# EAGLE design untitled (EAGLE 9.4.2)
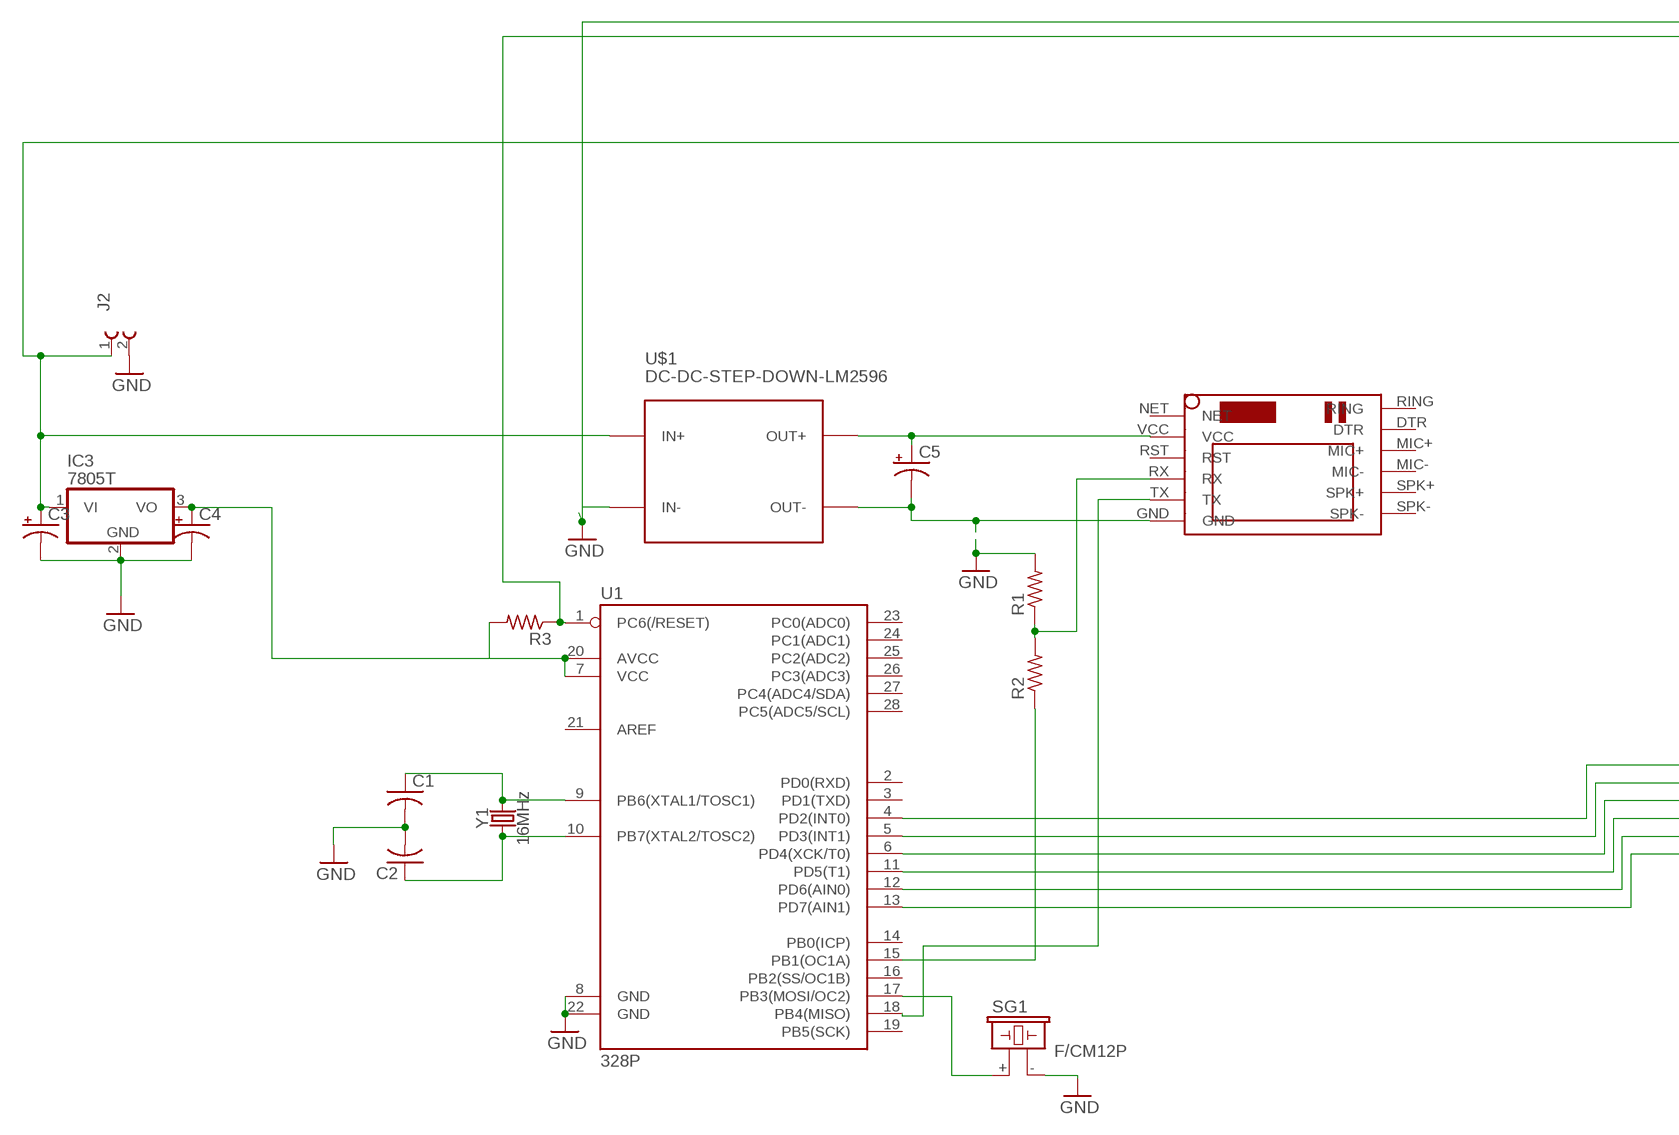
[diagram p0: schematic, sheet 1, part 1 of 2]
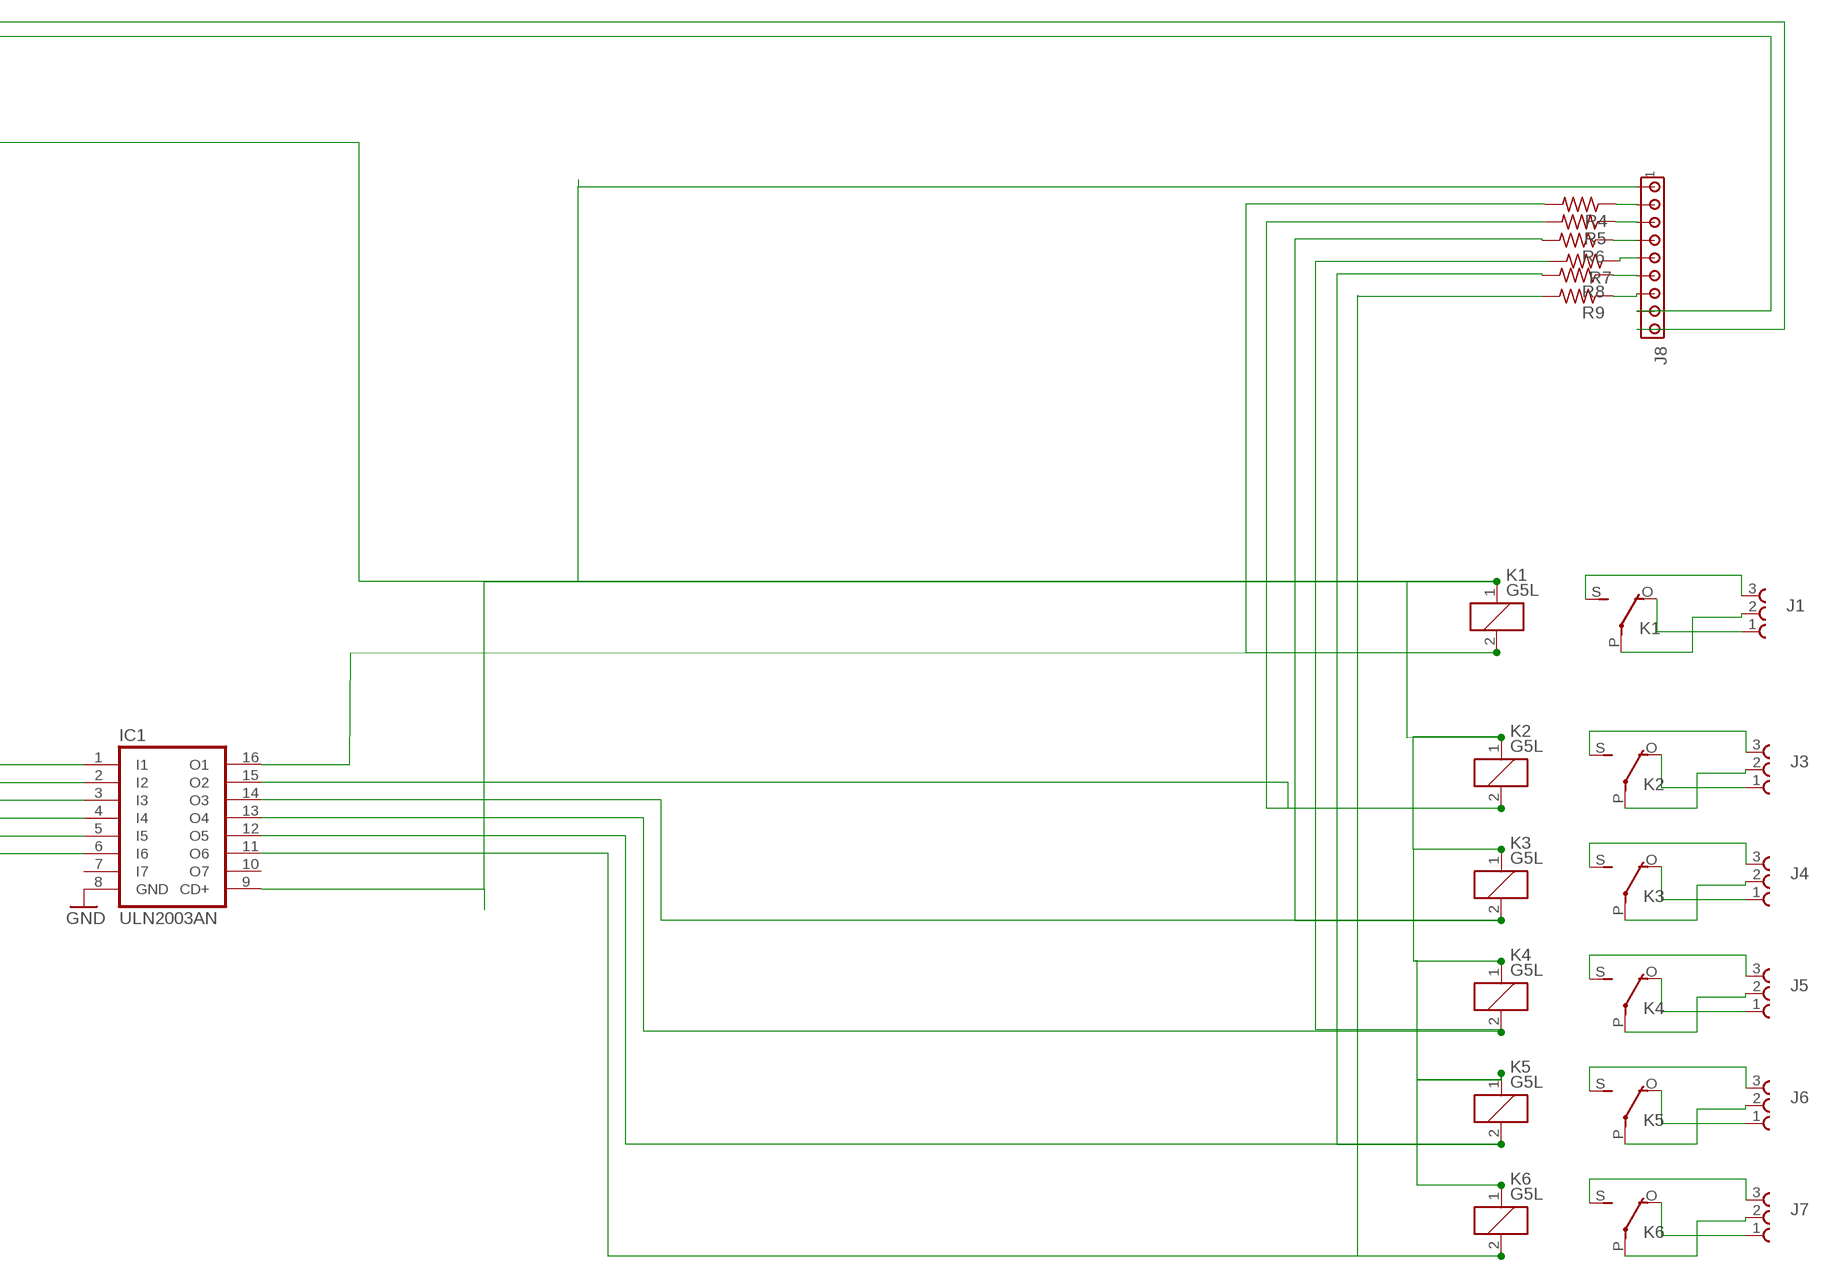
[diagram p1: schematic, sheet 1, part 2 of 2]

## Parts
C1  C-US025-024X044  [C025-024X044]
C2  C-US025-024X044  [C025-024X044]
C3  CPOL-USE2.5-5  [E2,5-5]
C4  CPOL-USE2.5-5  [E2,5-5]
C5  CAPACITOR-PE5-8.5  [E5-8,5]
IC1  ULN2003AN  [DIL16]
IC3  7805T  [TO220H]
J1  691216700003  [691216700003]
J2  691217910002  [691217910002]
J3  691216700003  [691216700003]
J4  691216700003  [691216700003]
J5  691216700003  [691216700003]
J6  691216700003  [691216700003]
J7  691216700003  [691216700003]
J8  MTA09-100  [10X09MTA]
K1  G5L  [G5LE]
K2  G5L  [G5LE]
K3  G5L  [G5LE]
K4  G5L  [G5LE]
K5  G5L  [G5LE]
K6  G5L  [G5LE]
R1  R-US_0204/7  [0204/7]
R2  R-US_0204/7  [0204/7]
R3  R-US_0204/7  [0204/7]
R4  R-US_0204/7  [0204/7]
R5  R-US_0204/7  [0204/7]
R6  R-US_0204/7  [0204/7]
R7  R-US_0204/7  [0204/7]
R8  R-US_0204/7  [0204/7]
R9  R-US_0204/7  [0204/7]
SG1  F/CM12P  [F/CM12P]
U1  328P  ATMEGA328P_PDIP  [DIP28]
U$1  DC-DC-STEP-DOWN-LM2596  [DC-DC-STEP-DOWN-LM2596]
U$2  SIM800LMODULE  [SIM800LMODULE]
Y1  16MHz  CRYSTAL-16MHZPTH-HC49US  [HC49US]

## Nets
GND: C1.2 C2.2 C3.- C4.- C5.- IC1.8(GND) IC3.2(GND) J2.2 J8.9 R1.2 SG1.- U1.8(GND) U1.22(GND) U$1.IN- U$1.OUT- U$2.GND
N$1: IC1.1(I1) U1.4(PD2(INT0))
N$2: C2.1 U1.10(PB7(XTAL2/TOSC2)) Y1.1
N$3: C1.1 U1.9(PB6(XTAL1/TOSC1)) Y1.2
N$4: IC1.2(I2) U1.5(PD3(INT1))
N$5: IC1.3(I3) U1.6(PD4(XCK/T0))
N$6: IC1.4(I4) U1.11(PD5(T1))
N$7: IC1.5(I5) U1.12(PD6(AIN0))
N$8: IC1.6(I6) U1.13(PD7(AIN1))
N$10: IC1.15(O2) K2.2 R5.2
N$11: C4.+ IC3.3(VO) R3.2 U1.7(VCC) U1.20(AVCC)
N$12: J8.2 R4.1
N$13: IC1.14(O3) K3.2 R6.2
N$14: IC1.13(O4) K4.2 R7.2
N$15: C5.+ U$1.OUT+ U$2.VCC
N$16: U1.18(PB4(MISO)) U$2.TX
N$17: R2.1 U1.15(PB1(OC1A))
N$18: R1.1 R2.2 U$2.RX
N$19: IC1.12(O5) K5.2 R8.2
N$20: J1.2 K1.P(2:P)
N$21: J1.3 K1.S(2:S)
N$22: J1.1 K1.O(2:O)
N$23: J8.3 R5.1
N$24: IC1.16(O1) K1.2 R4.2
N$25: J3.2 K2.P(2:P)
N$26: J3.3 K2.S(2:S)
N$27: J3.1 K2.O(2:O)
N$28: J8.8 R3.1 U1.1(PC6(/RESET))
N$29: J4.2 K3.P(2:P)
N$30: J4.3 K3.S(2:S)
N$31: J4.1 K3.O(2:O)
N$32: SG1.+ U1.17(PB3(MOSI/OC2))
N$33: J5.2 K4.P(2:P)
N$34: J5.3 K4.S(2:S)
N$35: J5.1 K4.O(2:O)
N$36: J8.4 R6.1
N$37: J6.2 K5.P(2:P)
N$38: J6.3 K5.S(2:S)
N$39: J6.1 K5.O(2:O)
N$40: C3.+ IC1.9(CD+) IC3.1(VI) J2.1 J8.1 K1.1 K2.1 K3.1 K4.1 K5.1 K6.1 U$1.IN+
N$41: J7.2 K6.P(2:P)
N$42: J7.3 K6.S(2:S)
N$43: J7.1 K6.O(2:O)
N$45: J8.5 R7.1
N$46: J8.6 R8.1
N$47: J8.7 R9.1
N$64: IC1.11(O6) K6.2 R9.2
Unconnected: IC1.7(I7) IC1.10(O7) U1.2(PD0(RXD)) U1.3(PD1(TXD)) U1.14(PB0(ICP)) U1.16(PB2(SS/OC1B)) U1.19(PB5(SCK)) U1.21(AREF) U1.23(PC0(ADC0)) U1.24(PC1(ADC1)) U1.25(PC2(ADC2)) U1.26(PC3(ADC3)) U1.27(PC4(ADC4/SDA)) U1.28(PC5(ADC5/SCL)) U$2.DTR U$2.MIC+ U$2.MIC- U$2.NET U$2.RING U$2.RST U$2.SPK+ U$2.SPK-

## Library data of the parts
C1 C2 = adafruit:C-US: CAPACITOR, American symbol
C3 C4 = adafruit:CPOL-US: POLARIZED CAPACITOR, American symbol
C5 = BeagleBone_Blue_R3:CAPACITOR-P: POLARIZED CAPACITOR, American symbol
IC1 = uln-udn:ULN2003A: DRIVER ARRAY
IC3 = adafruit:78*: Positive VOLTAGE REGULATOR Added bigger pads to the TO-92 package
J1 J3-J7 = Wurth_Elektronik_Electromechanic_Terminal_Blocks_Connectors_rev19b:691216700003: SERIE 2167 - 5.00 MM - VERTICAL CABLE ENTRY WITH RISING CAGE CLAMP - WR-TBL =>ConTBL2 691216700003 Characteristics INSULATOR:PA6/66 FLAMABILITY RATING: UL94V0 COLOR: GREEN METAL HOUSING: COPPER ALLOY / Ni+Sn TERMINAL SCREW: STEEL / Zn WIRE GUARD: COPPER ALLOY / Ni+Sn OPERATING TEMPERATURE:-30°C UP TO +120°C COMPLIANCE: LEAD FREE AND ROHS ELECTRICAL UL VDE CURRENT RATING: 14A 24A WORKING VOLTAGE: 300VAC 250VAC WITHSTANDING VOLTAGE: 1,6KV 2KV CONTACT RESISTANCE: 20 mOhm max <http://katalog.we-online.de/media/images/v2/Family_WR-TBL_5_00_2167_VERTICAL_CABLE_ENTRY_W_RISING_CLAMP_6912167000XX.jpg> Details see: http://katalog.we-online.de/en/em/TBL_5_00_2167_VERTICAL_CABLE_ENTRY_W_RISING_CLAMP_6912167000XX 2015 (C) Wurth Elektronik
J2 = Wurth_Elektronik_Electromechanic_Terminal_Blocks_Connectors_rev19b:691217910002: WR-TBL Terminal block - serie 2179 - 2 Pins;=>Code : Con_TBL_Screw_RisingClamp_7.50_6912179100xx_691217910002 Created 11/27/2014, Karrer Zheng 2014 (C) Wurth Elektronik
J8 = con-amp:MTA09-100: AMP connector
K1-K6 = relay:G5L: RELAY 1 x switch, 10 A/120 V AC, 8 A/30 V ADC, Omron; OC_FARNELL: unknown; OC_NEWARK: unknown
R1-R9 = adafruit:R-US_: RESISTOR, American symbol
SG1 = buzzer:F/CM12P: BUZZER Source: Buerklin; OC_FARNELL: unknown; OC_NEWARK: unknown
U1 = SparkFun-IC-Microcontroller:ATMEGA328P_PDIP: Atmel 328P Through hole ATMEGA328P uC used in the Arduino 32kb flash, 1k EEPROM, 2k SRAM Datasheet <http://www.sparkfun.com/datasheets/Components/SMD/ATMega328.pdf> SparkFun Products Storefront component: AVR 28 Pin 20MHz 32K 6A/D - ATMega328P <https://www.sparkfun.com/products/9061> (COM-09061) SparkFun Simon Says - Through-Hole Soldering Kit <https://www.sparkfun.com/products/10547> (KIT-10547) SparkFun Learn to Solder - Simon Says <https://www.sparkfun.com/products/13708> (KIT-13708) SparkFun BigTime Watch Kit <https://www.sparkfun.com/products/11734> (KIT-11734) SparkFun ClockIt <https://www.sparkfun.com/products/10930> (KIT-10930) SparkFun Serial Enabled LCD Kit <https://www.sparkfun.com/products/10097> (LCD-10097) SparkFun Simon Tilts - Through Hole Soldering Kit <https://www.sparkfun.com/products/12634> (KIT-12634) SparkFun Frequency Counter Kit <https://www.sparkfun.com/products/10140> (KIT-10140) FabFM Radio Kit <https://www.sparkfun.com/products/11043> (KIT-11043) SparkFun Binary Blaster Kit <https://www.sparkfun.com/products/12037> (KIT-12037) SparkFun Metro-Gnome <https://www.sparkfun.com/products/9236> (KIT-09236) ATmega328 with Arduino Optiboot (Uno) <https://www.sparkfun.com/products/10524> (DEV-10524); PROD_ID: IC-09136
U$1 = diy-modules:DC-DC-STEP-DOWN-LM2596: DC/DC Step-Down Regulator based on LM2596-ADJ chip LM2596 datasheet available here: http://www.ti.com/lit/ds/symlink/lm2596.pdf Click here to find device on ebay.com <http://www.ebay.com/sch/lm2596+power+regulator>
U$2 = SIM800LMODULE:SIM800LMODULE: SIM800L Module
Y1 = SparkFun-Clocks:CRYSTAL-16MHZ: 16MHz Crystal Digikey Example <http://www.digikey.com/product-search/en?keywords=535-9122-1-ND> Frequency: 16MHz Frequency Stability: ±50ppm Frequency Tolerance: ±20ppm Load Capacitance: 18pF SparkFun Products: Pro Micro -5V/16MHz <https://www.sparkfun.com/products/12640> SparkFun Serial Enabled LCD Kit <https://www.sparkfun.com/products/10097>; PROD_ID: XTAL-08181; SF_ID: COM-00536

## Board
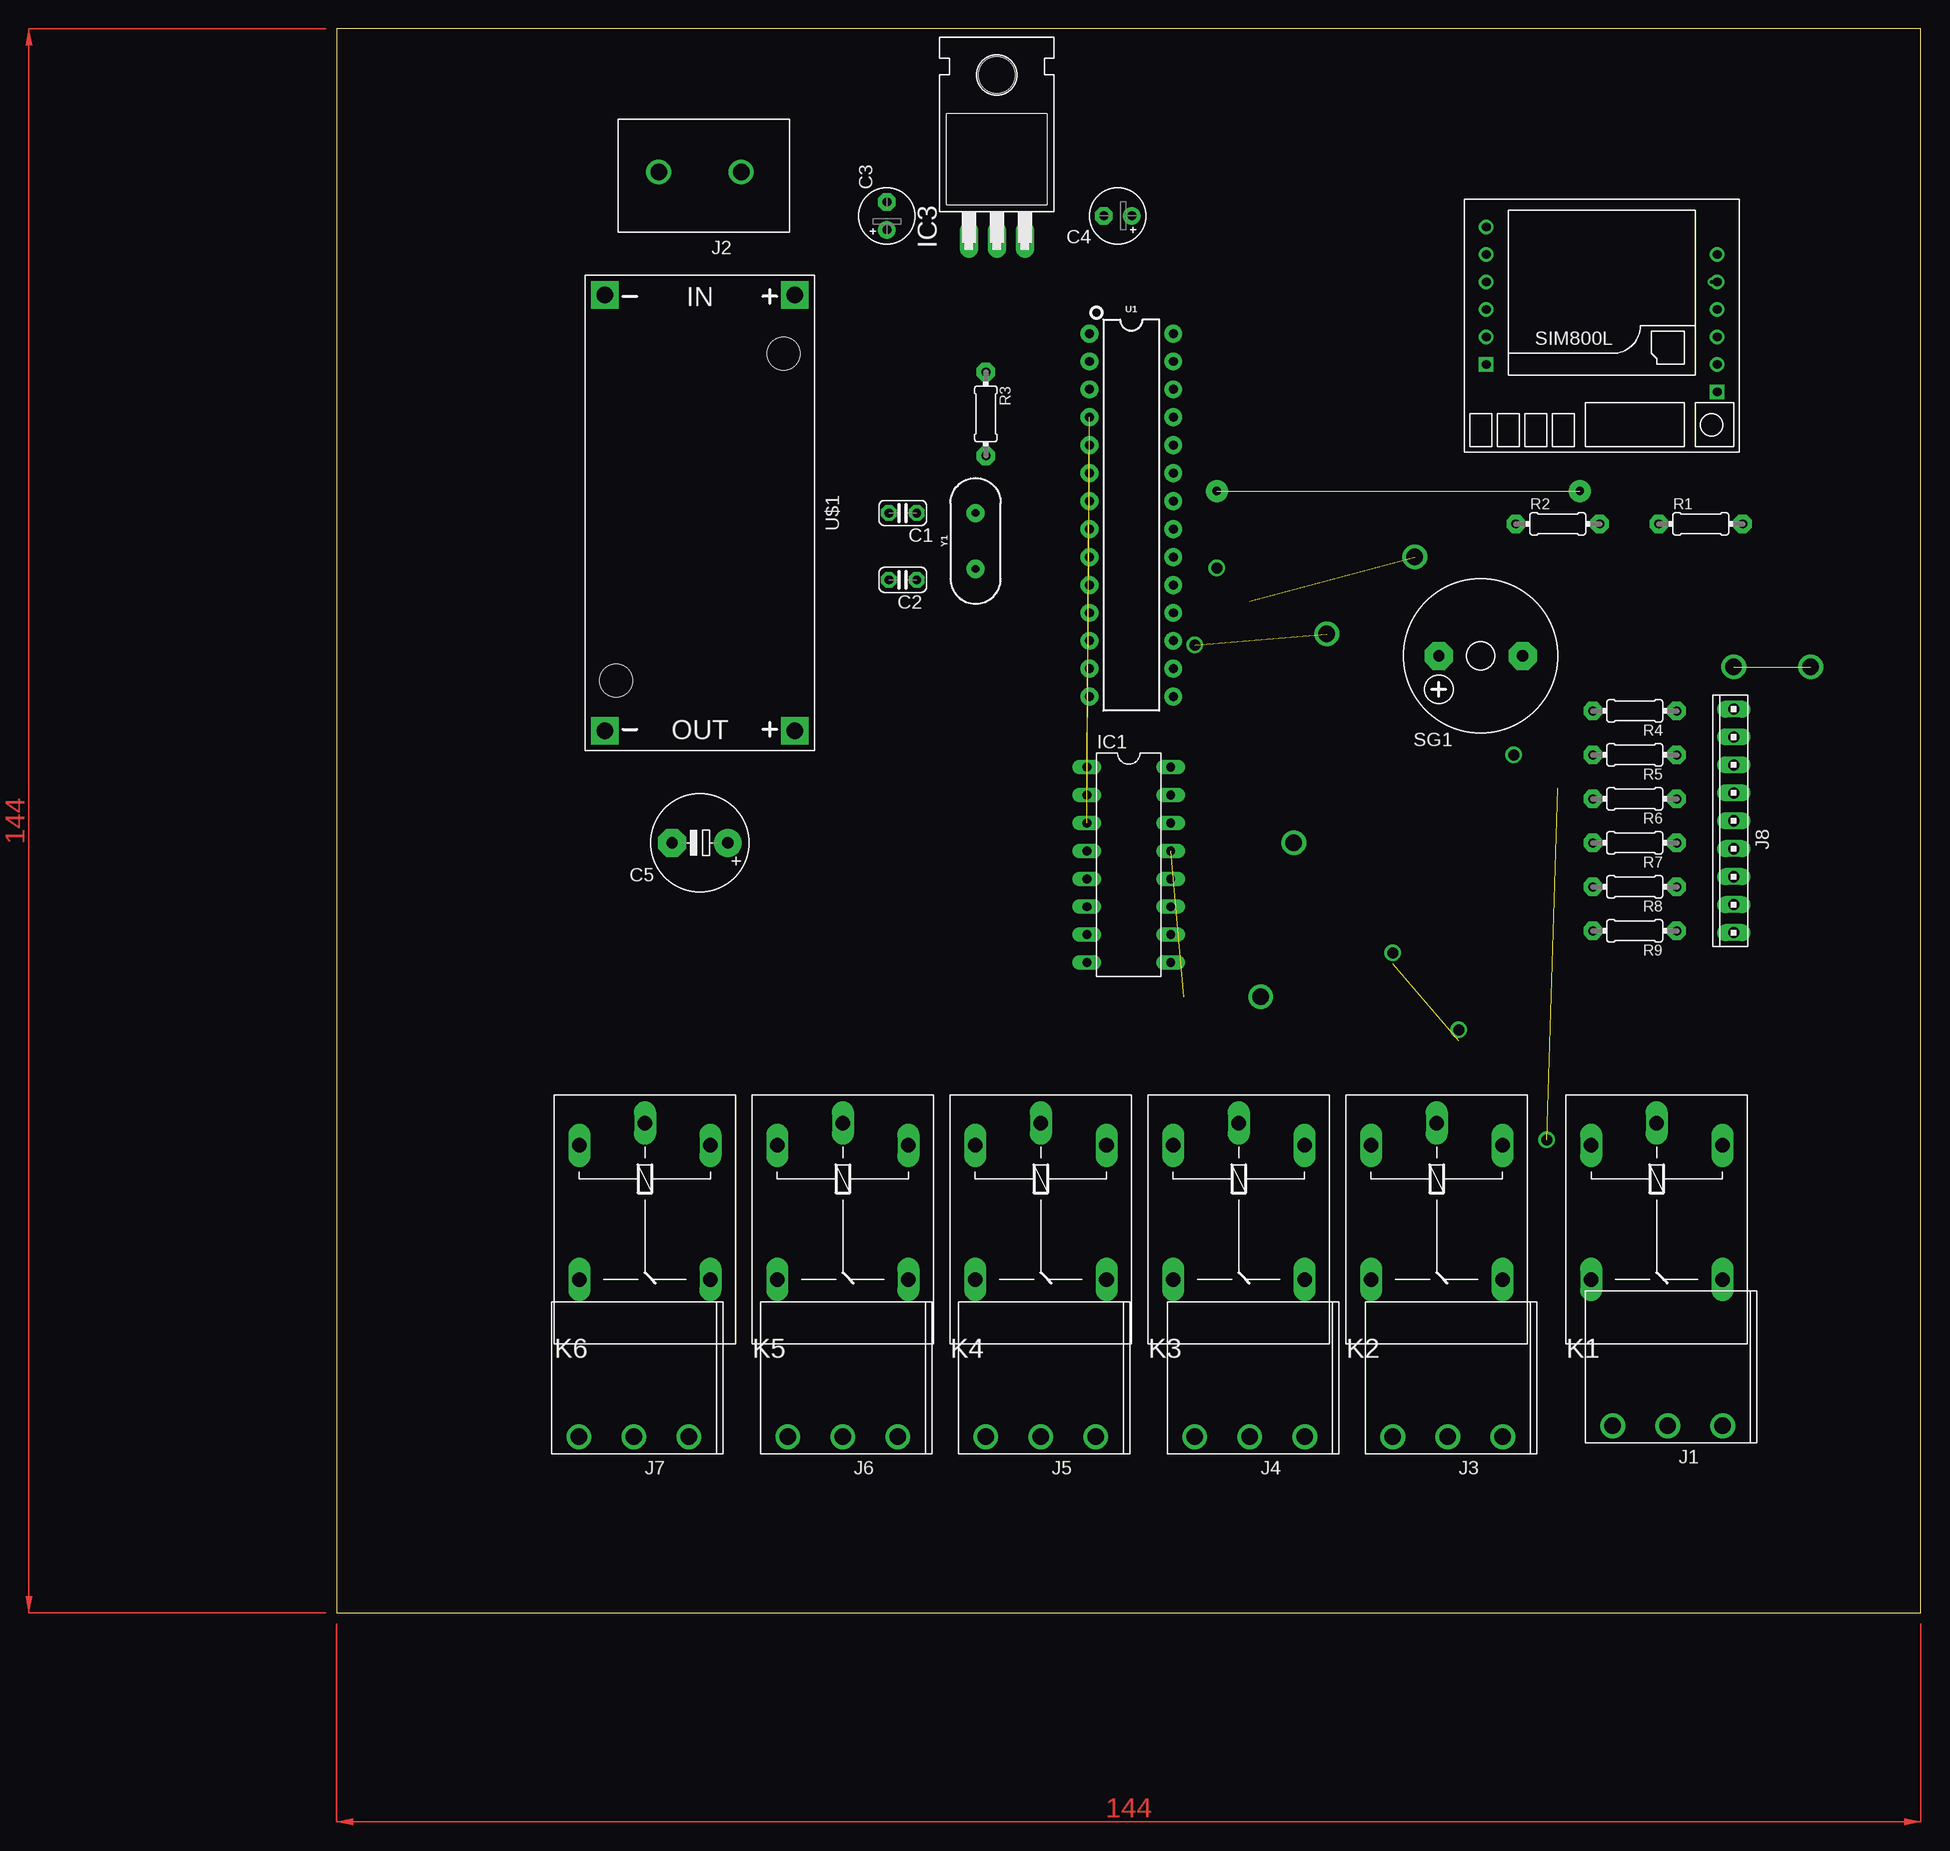
[diagram p2: board, top side]
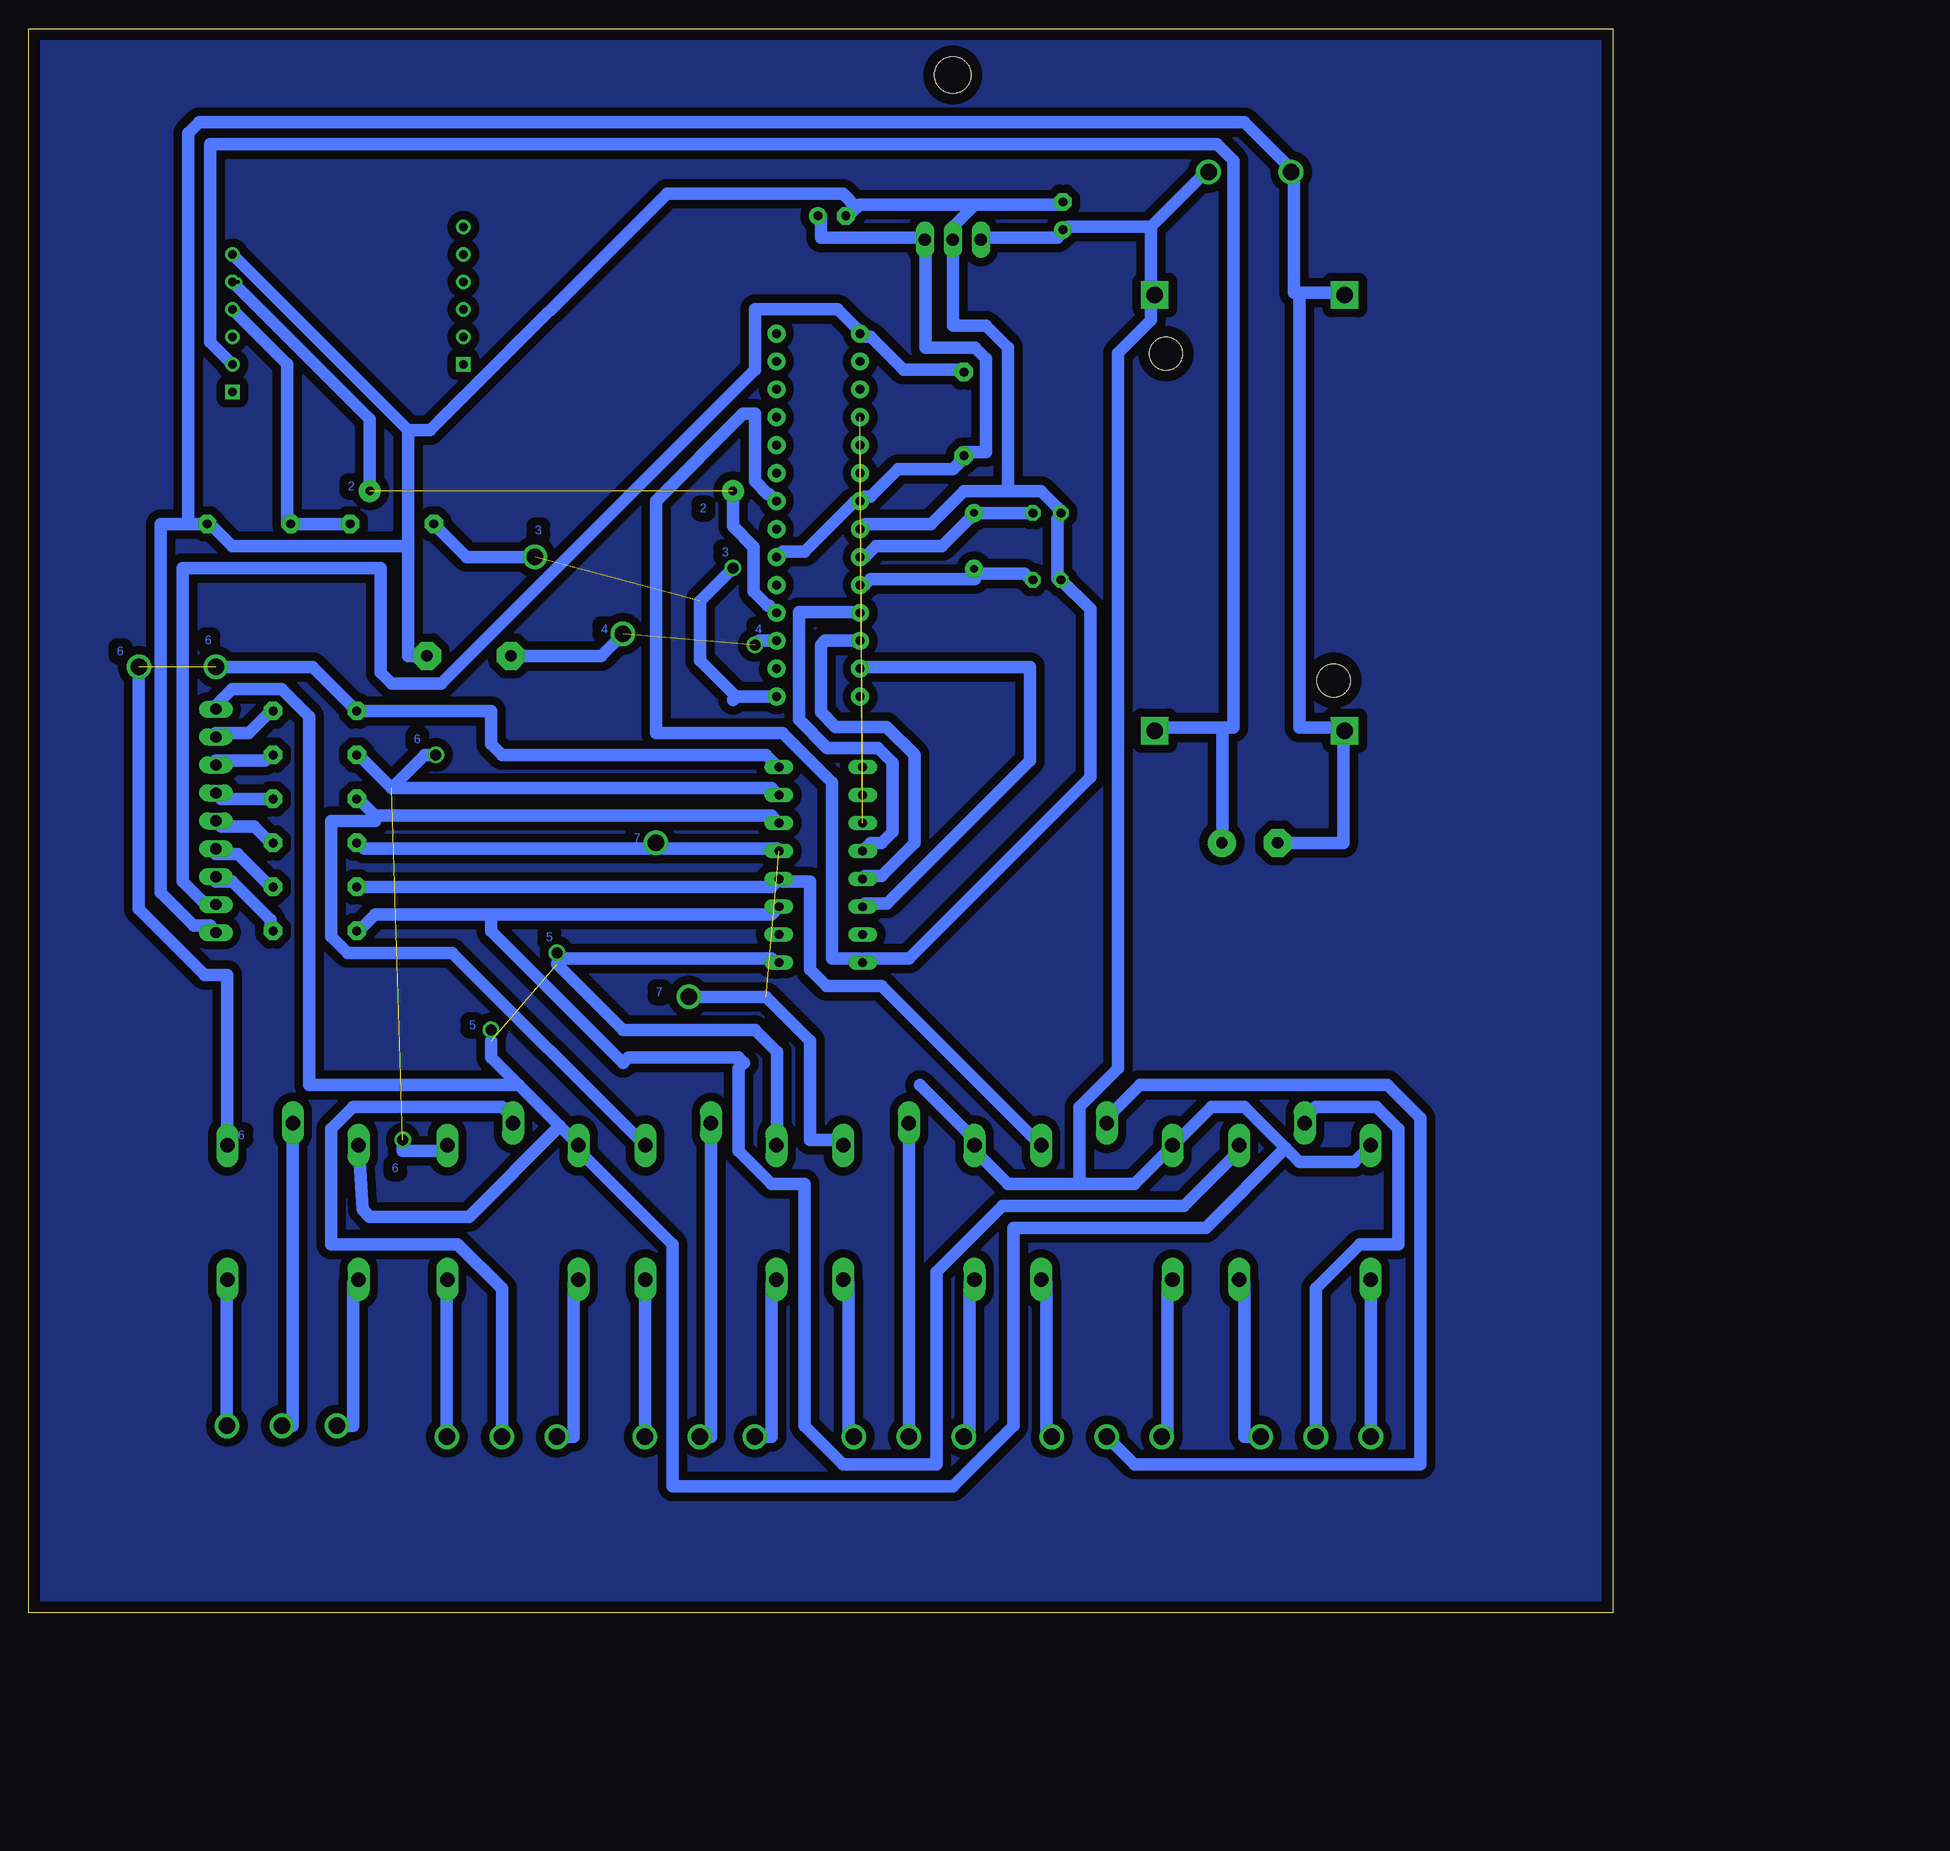
[diagram p3: board, bottom side, seen from below]

Size 144 x 144 mm. Coordinates in mm from the lower left corner, seen from the top.
Outline: 0,0 144,0 144,144 0,144 0,0
Copper layers (1*16): Top 0.035mm / dielectric 1.5mm / Bottom 0.035mm
Design rules "default *": minimum track width 45mil, minimum drill 0.35mm, track to track 30mil, track to pad 20mil, pad to pad 6mil, via to via 6mil, smd to smd 6mil, copper to edge 40mil, drill to drill 6mil, minimum pad ring 10mil, minimum via ring 8mil, stop-mask expansion 4mil, vias tented up to drill 0mil, thermal gap 10mil

### Footprints (pad centres in the part's own frame; a part is rotated, then mirrored left to right if it is on the bottom)
C025-024X044 = drill 0.813 pad 1.422 octagon: 1 -1.27,0; 2 1.27,0
E2,5-5 = drill 0.813 pad 1.6: + -1.27,0 | drill 0.813 pad 1.6 octagon: - 1.27,0
E5-8,5 = drill 1.016 pad 2.54: + -2.54,0 | drill 1.016 pad 2.54 octagon: - 2.54,0
DIL16 = drill 0.813 long: 1 -8.89,-3.81; 2 -6.35,-3.81; 3 -3.81,-3.81; 4 -1.27,-3.81; 5 1.27,-3.81; 6 3.81,-3.81; 7 6.35,-3.81; 8 8.89,-3.81; 9 8.89,3.81; 10 6.35,3.81; 11 3.81,3.81; 12 1.27,3.81; 13 -1.27,3.81; 14 -3.81,3.81; 15 -6.35,3.81; 16 -8.89,3.81
TO220H = drill 1.118 long: 1 -2.54,-10.16; 2 0,-10.16; 3 2.54,-10.16 | hole 3.302: 0,4.826
691216700003 = drill 1.5: 1 -5,0; 2 0,0; 3 5,0
691217910002 = drill 1.5: 1 -3.75,0; 2 3.75,0
10X09MTA = drill 1.016 long: 1 10.16,0; 2 7.62,0; 3 5.08,0; 4 2.54,0; 5 0,0; 6 -2.54,0; 7 -5.08,0; 8 -7.62,0; 9 -10.16,0
G5LE = drill 1.321 long: 1 -7.493,-5.969; 2 -7.493,5.969; O 4.699,5.969; P -9.525,0; S 4.699,-5.969
0204/7 = drill 0.813 pad 1.676 octagon: 1 -3.81,0; 2 3.81,0
F/CM12P = drill 1.016 pad 2.54 octagon: + 3.81,0; - -3.81,0
DIP28 = drill 0.813 pad 1.626: 1 -16.51,-3.81; 2 -13.97,-3.81; 3 -11.43,-3.81; 4 -8.89,-3.81; 5 -6.35,-3.81; 6 -3.81,-3.81; 7 -1.27,-3.81; 8 1.27,-3.81; 9 3.81,-3.81; 10 6.35,-3.81; 11 8.89,-3.81; 12 11.43,-3.81; 13 13.97,-3.81; 14 16.51,-3.81; 15 16.51,3.81; 16 13.97,3.81; 17 11.43,3.81; 18 8.89,3.81; 19 6.35,3.81; 20 3.81,3.81; 21 1.27,3.81; 22 -1.27,3.81; 23 -3.81,3.81; 24 -6.35,3.81; 25 -8.89,3.81; 26 -11.43,3.81; 27 -13.97,3.81; 28 -16.51,3.81
DC-DC-STEP-DOWN-LM2596 = drill 1.5 pad 2.5 square: IN+ -19.812,8.636; IN- -19.812,-8.636; OUT+ 19.812,8.636; OUT- 19.812,-8.636 | hole 3: -14.478,7.62; 15.24,-7.62
SIM800LMODULE = drill 0.8: DTR 10.5,1; GND -10.5,-6.5; MIC+ 10.5,-1.5; MIC- 10.5,-4; RST -10.5,1; RX -10.5,-1.5; SPK+ 10.5,-6.5; SPK- 10.5,-9; TX -10.5,-4; VCC -10.5,3.5 | drill 0.8 square: NET -10.5,6; RING 10.5,3.5
HC49US = drill 0.7 pad 1.651: 1 -2.54,0; 2 2.54,0

### Placement (x,y rotation side)
C1  51.45,99.99 180 top
C2  51.45,93.91 180 top
C3  50,127 90 top
C4  71,127 180 top
C5  33,70 180 top
IC1  72,68 270 top
IC3  60,135 0 top
J1  121,17 180 top
J2  33,131 180 top
J3  101,16 180 top
J4  83,16 180 top
J5  64,16 180 top
J6  46,16 180 top
J7  27,16 180 top
J8  127,72 90 top
K1  120,35 270 top
K2  100,35 270 top
K3  82,35 270 top
K4  64,35 270 top
K5  46,35 270 top
K6  28,35 270 top
R1  124,99 0 top
R2  111,99 0 top
R3  59,109 270 top
R4  118,82 180 top
R5  118,78 180 top
R6  118,74 180 top
R7  118,70 180 top
R8  118,66 180 top
R9  118,62 180 top
SG1  104,87 180 top
U1  72.23,99.8 270 top
U$1  33,100 270 top
U$2  115,117 180 top
Y1  58.07,97.45 90 top

### Tracks (layer width: path | path; a pad name or v marks a point on that pad's centre or on a via)
GND
  Bottom 1.143: 58,128 50,128 C3.- | 58,128 60,126 IC3.2 60,117 57,117 55,115 55,102 | 68.75,127.75 68.5,128 58,128 | 68.75,127.75 69.5,127 C4.- | 55,102 52,102 50.5,100.5 C1.2 50.5,99.5 50.5,94 C2.2 47.5,91.23 47.5,76 64,59.5 68,59.5 IC1.8 68.5,59.5 71,59.5 71,75.5 75.5,80 87,80 87,101.07 79.07,109 78,109 78,102.89 76.82,101.72 76.69,101.72 U1.22 | 55,102 59,102 62,99 68,99 U1.8 | 28.5,120 24.5,120 U$1.IN- | 28.5,120 29,120 29,131 J2.2 29.5,131.5 33.5,135.5 128.5,135.5 129.5,134.5 129.5,99 | C5.- 24.5,70 24.5,80 U$1.OUT- 24.5,80.5 28.5,80.5 28.5,120 | 129.5,99 R1.2 127.5,99 125.5,97 109.5,97 | 129.5,99 132,99 132,65.5 129,62.5 127.5,62.5 127,62 J8.9 | 109.5,107.5 U$2.GND | 109.5,97 109.5,87 SG1.- | 109.5,97 109.5,107.5 | 68.75,127.75 70,129 86,129 107.5,107.5 109.5,107.5
N$1  (1 unrouted)
N$2
  Bottom 1.143: 58,94.5 53.5,94.5 53,94 C2.1 | 58,94.5 Y1.1 | U1.10 68,93.5 67.5,94 58,94 58,94.5
N$3
  Bottom 1.143: C1.1 53,100 58,100 Y1.2 58.5,99.5 61,97 67,97 68,96 U1.9
N$4  (1 unrouted)
N$5  (1 unrouted)
N$6
  Bottom 1.143: IC1.4 68,69.5 67.5,70 66.5,70 65.5,71 65.5,77.32 66.81,78.63 71.44,78.63 74,81.19 74,91 68.51,91 U1.11
N$7
  Bottom 1.143: IC1.5 68,67 66.5,67 63.5,70 63.5,78.02 66.02,80.53 70.65,80.53 72,81.89 72,88 71.63,88.37 U1.12
N$8
  Bottom 1.143: IC1.6 68,64.5 66,64.5 53,77.5 53,86 68.25,86 U1.13
N$10  (via drill 1)  (1 unrouted)
  Bottom 1.143: 111,75 76.5,75 76,74.5 IC1.15 | 111,75 114,78 R5.2 | 111,75 108,78 v107,78 | K2.2 106.46,42 110,42 v110,43
N$11
  Bottom 1.143: C4.+ 72,127 72,125 63,125 IC3.3 62.5,124.5 62.5,115 58,115 57,114 57,105.5 59,105.5 R3.2 59,105 60,104 65,104 67.5,101.5 68,101.5 U1.7 68.5,101 69,101 73.5,96.5 75.5,96.5 76,96 U1.20
N$12
  Bottom 1.143: J8.2 127,80 124,80 122,82 R4.1
N$13
  Bottom 1.143: IC1.14 76.5,72.5 112.5,72.5 | 112.5,72.5 114,74 R6.2 | K3.2 88,42.5 105.5,60 115,60 116.5,61.5 116.5,72 112.5,72 112.5,72.5
N$14  (via drill 1.5)  (1 unrouted)
  Bottom 1.143: IC1.13 76,69.5 113.5,69.5 114,70 R7.2 | K4.2 70.48,43 73,43 73,52 77,56 v84,56
N$15
  Bottom 1.143: U$2.VCC 127.5,115.5 127.5,133.5 36,133.5 34.5,132 34.5,80.5 35.5,80.5 | 35.5,80.5 41.5,80.5 U$1.OUT+ | 35.5,80.5 35.5,70 C5.+
N$16  (via drill 0.75 pad 2)  (1 unrouted)
  Bottom 1.143: U1.18 76.69,91.56 76.82,91.56 78.09,92.83 78.09,96.91 80,98.81 v80,102 | U$2.TX 113,108.5 v113,102
N$17  (via drill 1, 1.5)  (1 unrouted)
  Bottom 1.143: U1.15 79.71,83.29 | 79.71,83.29 80,83 | 79.71,83.29 83,86.58 83,92 v80,95 | R2.1 104.19,96 v98,96
N$18
  Bottom 1.143: U$2.RX 120.5,113.5 120.5,99 R1.1 R2.2
N$19
  Bottom 1.143: R8.2 76.5,66 76,66.5 IC1.12 75.5,66.5 73,66.5 73,58.5 71.5,57 66.5,57 52,42.5 K5.2
N$20
  Bottom 1.143: K1.P 120,17 J1.2
N$21
  Bottom 1.143: J1.3 114.5,17 114.5,30 K1.S
N$22
  Bottom 1.143: J1.1 126,30 K1.O
N$23
  Bottom 1.143: J8.3 127,77.5 122.5,77.5 122,78 R5.1
N$24  (via drill 1, 1.5)  (1 unrouted)
  Bottom 1.143: IC1.16 76,77 77,78 101,78 102,79 102,82 R4.2 | 114,82 R4.2 | K1.2 125.97,57.97 126,58 128,58 134,64 v134,86 | R4.2 118.19,86 v127,86
N$25
  Bottom 1.143: J3.2 101,29.5 105,33.5 116.5,33.5 116.5,44 114.5,46 101,46 100,45 K2.P
N$26
  Bottom 1.143: J3.3 94.5,16 94.5,30 K2.S
N$27
  Bottom 1.143: J3.1 106,30 K2.O
N$28
  Bottom 1.143: J8.8 127,64.5 128,64.5 130,66.5 130,95 112,95 112,85.5 111,84.5 106.5,84.5 78,113 78,118.5 70.5,118.5 68.5,116.5 U1.1 68,116 67.5,116 64.5,113 59,113 R3.1
N$29
  Bottom 1.143: K3.P 82,16 J4.2
N$30
  Bottom 1.143: J4.3 76.5,16 76.5,30 K3.S
N$31
  Bottom 1.143: J4.1 88,30 K3.O
N$32  (via drill 1, 1.5)  (1 unrouted)
  Bottom 1.143: SG1.+ 92,87 v90,89 | U1.17 77.63,88.37 v78,88
N$33
  Bottom 1.143: J5.2 K4.P
N$34
  Bottom 1.143: J5.3 58.5,16 58.5,30 K4.S
N$35
  Bottom 1.143: J5.1 69.5,16 69.5,30 K4.O
N$36
  Bottom 1.143: R6.1 126.5,74 127,74.5 J8.4
N$37
  Bottom 1.143: J6.2 43.5,13.5 17.5,13.5 17.5,45 20.5,48 43,48 46,45 K5.P
N$38
  Bottom 1.143: J6.3 40.5,16 40.5,30 K5.S
N$39
  Bottom 1.143: J6.1 51.5,16 51.5,30 K5.O
N$40  (1 unrouted)
  Bottom 1.143: 99.5,48 118.5,48 118.5,81.5 121,84 125.5,84 127,82.5 J8.1 | 95.75,44.25 94,42.5 K2.1 94,42 85.5,33.5 85.5,11.5 60,11.5 54.5,17 54.5,35 37,35 29.75,42.25 | 95.75,44.25 99.5,48 | 95.75,44.25 104,36 113,36 113.67,36.66 K1.1 | IC3.1 57,125 50.5,125 50,125.5 C3.+ 49.5,126 42,126 | 42,126 37,131 J2.1 | 42,126 42,120 U$1.IN+ 42,119.5 42,117.5 45,114.5 45,49.5 48.5,46 48.5,39 | IC1.9 76,59 76.5,59.5 95.5,59.5 96,59 90,53 78,53 76,51 76,42.5 K3.1 | 29.75,42.25 33.5,46 36.5,46 40,42.5 K5.1 40.5,42 43.5,39 48.5,39 | 29.75,42.25 28.5,41 23.5,41 22.5,42 K6.1 | 48.5,39 55,39 58,42 K4.1 58,43 63,48 | 99.5,48 102,50.5 102,52
N$41
  Bottom 1.143: J7.2 27,29.5 23,33.5 19.5,33.5 19.5,44 21.5,46 27,46 28,45 K6.P
N$42
  Bottom 1.143: J7.3 22,30 K6.S
N$43
  Bottom 1.143: J7.1 33.5,16 33.5,30 K6.O
N$45
  Bottom 1.143: J8.5 126.5,71.5 123.5,71.5 122,70 R7.1
N$46
  Bottom 1.143: J8.6 127,69 125,69 122,66 R8.1
N$47
  Bottom 1.143: J8.7 127,66.5 125.5,66.5 122,63 122,62 R9.1
N$48  (via drill 0.35)
  other vias: 125,121
N$49  (via drill 1)
  other vias: 96,60
N$50  (via drill 1)
  other vias: 102,53
N$51  (via drill 1.5)
  other vias: 87,70
N$52
  pour Bottom: 0,144 144,144 144,0 0,0
N$64
  Bottom 1.143: IC1.11 76.5,63.5 102,63.5 | 102,63.5 112.5,63.5 114,62 R9.2 | K6.2 34,42 39,37 55.5,37 61.5,31 61.5,13.5 70,13.5 73.5,17 73.5,39 76.5,39 79.5,42 79.5,49.5 79,50 79.5,50.5 89.5,50.5 90,50 102,62 102,63.5
(copper drawn outside any net)
  shapes: Top area x2

### Text on the board
Bottom: 2 | 2 | 3 | 3 | 4 | 4 | 6 | 6 | 6 | 7 | 5 | 7 | 5 | 6 | 6